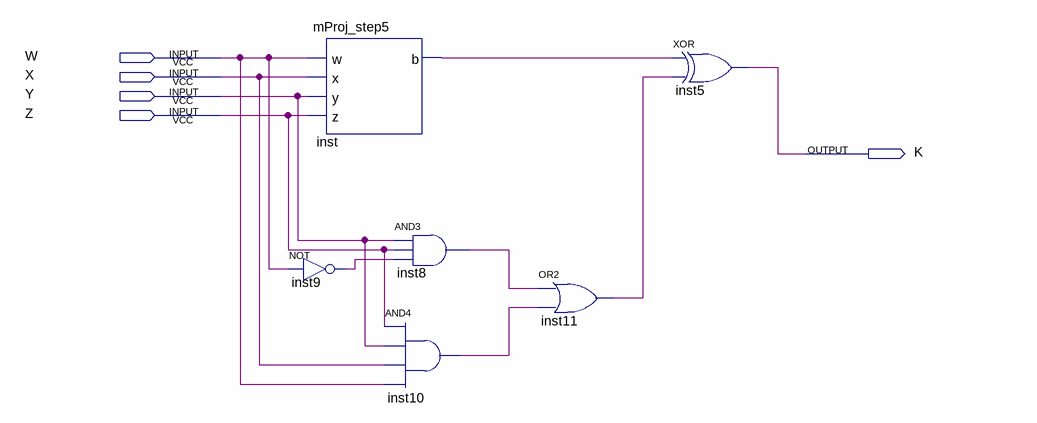
[diagram p0: schematic sheet]
// Quartus schematic mProj_step8.bdf as structural Verilog: 6 symbols, 5 pins
module mProj_step8 (
  input  W,
  input  X,
  input  Y,
  input  Z,
  output K
);

  wire inst8_out, inst9_out, inst10_out, inst11_out, inst_b;

  mProj_step5 inst (.w(W), .x(X), .y(Y), .z(Z), .b(inst_b));
  not inst9 (inst9_out, W);
  and inst10 (inst10_out, Z, Y, X, W);
  and inst8 (inst8_out, Y, Z, inst9_out);
  or inst11 (inst11_out, inst8_out, inst10_out);
  xor inst5 (K, inst_b, inst11_out);
endmodule
